# EAGLE schematic PR9023 (EAGLE 6.6.0)
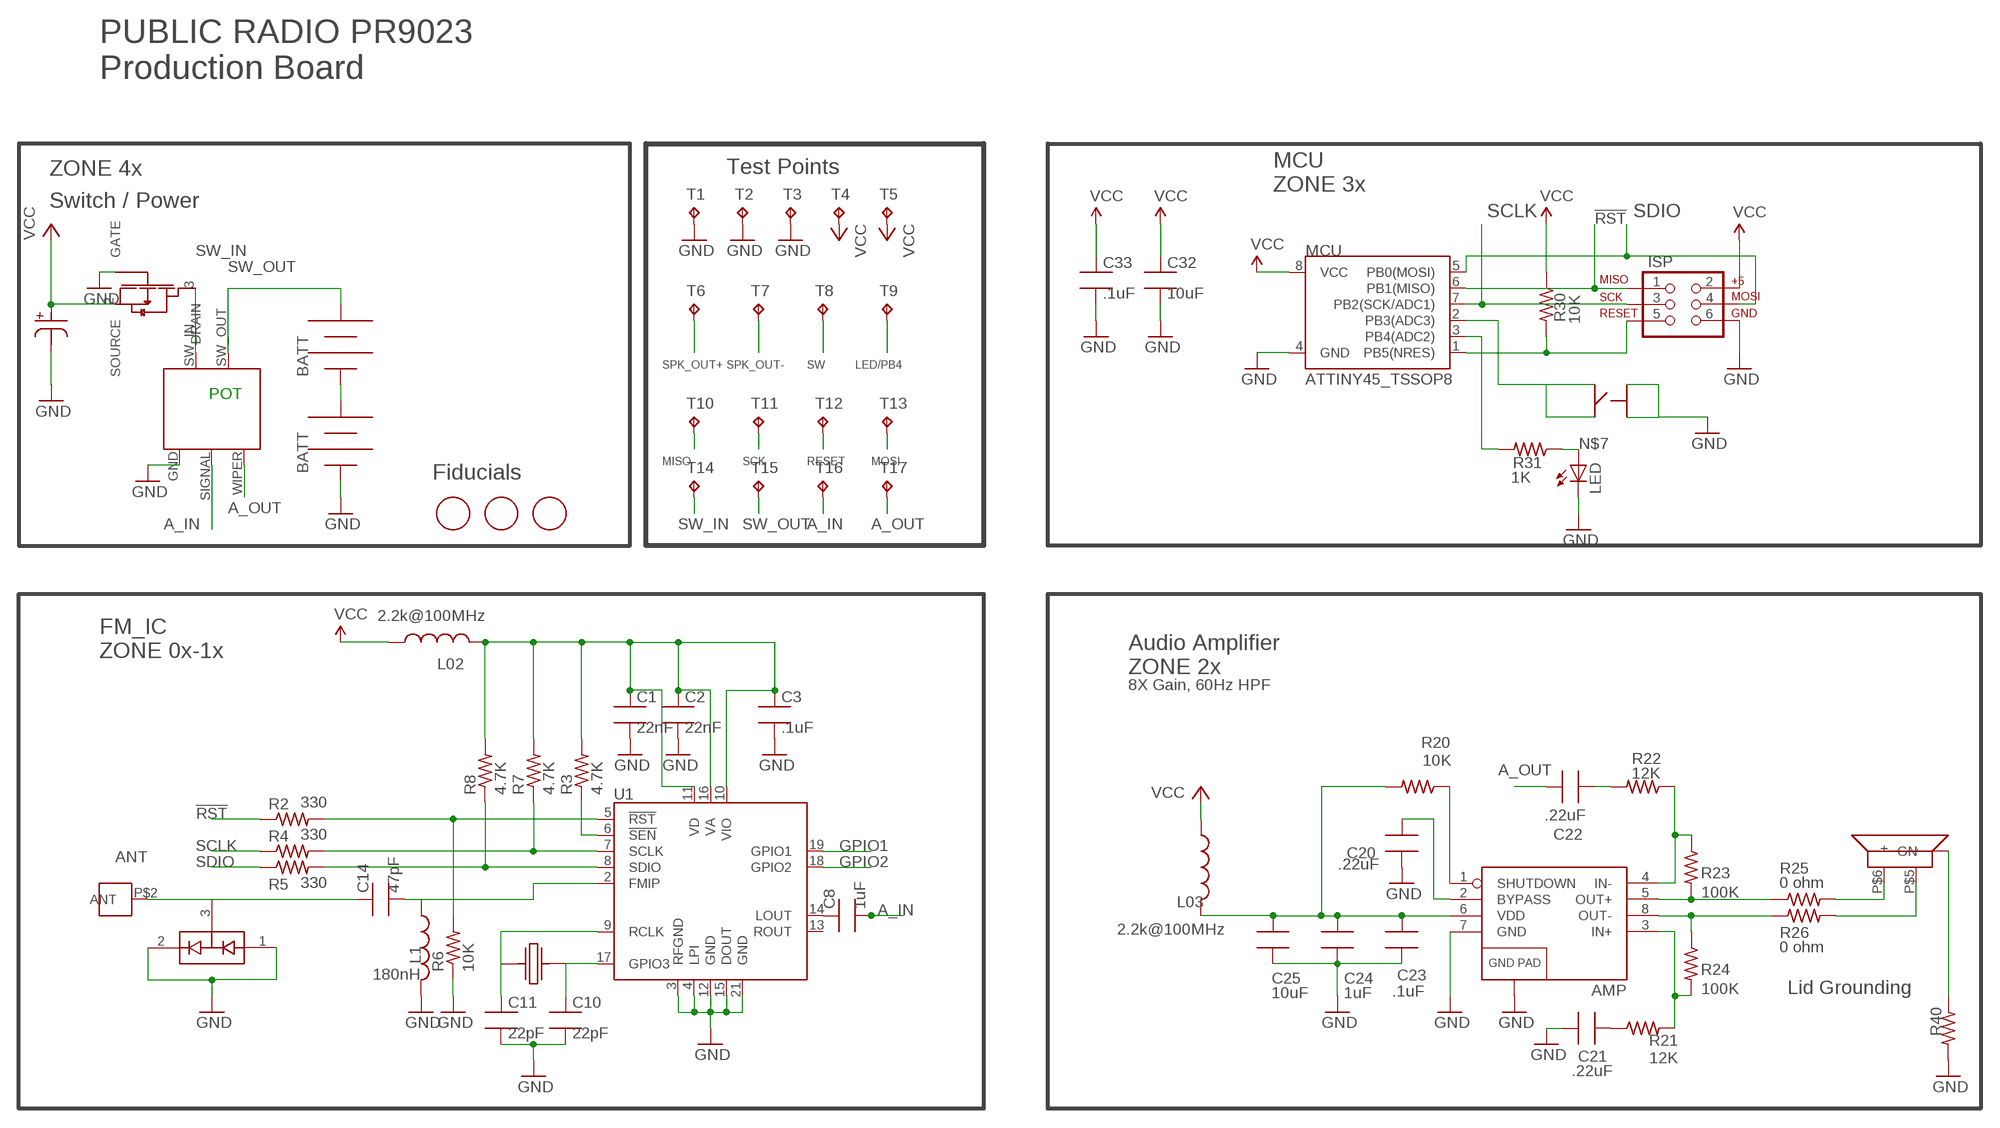
[diagram p0: schematic, sheet 1]

## Parts
AMP  TPA6203A1  [8-MSOP]
ANT_MOUNT  DNP  M3_PEMNUT  [PEM_M3]
C1  22nF  C_SMT_0603_CPL  [0603_CPL]
C2  22nF  C_SMT_0603_CPL  [0603_CPL]
C3  .1uF  C_SMT_0603_CPL  [0603_CPL]
C8  1uF  C_SMT_0603_CPL  [0603_CPL]
C10  22pF  C_SMT_0603_CPL  [0603_CPL]
C11  22pF  C_SMT_0603_CPL  [0603_CPL]
C14  47pF  C_SMT_0603_CPL  [0603_CPL]
C20  .22uF  C_SMT_0603_CPL  [0603_CPL]
C21  .22uF  C_SMT_0603_CPL  [0603_CPL]
C22  .22uF  C_SMT_0603_CPL  [0603_CPL]
C23  .1uF  C_SMT_0603_CPL  [0603_CPL]
C24  1uF  C_SMT_0603_CPL  [0603_CPL]
C25  10uF  C_SMT_0603_CPL  [0603_CPL]
C32  10uF  C_SMT_0603_CPL  [0603_CPL]
C33  .1uF  C_SMT_0603_CPL  [0603_CPL]
C40  220uF  NICHICON_SERIESUD  [NICHICON_UD_63]
D1  BAV99  [SOT23_CPL]
FET1  AO3435  [SOT23_CPL]
ISP  AVR_SPI_PRG_6NS  [2X3-NS]
JP5  BK-92_MPD_AA_BATT_CLIP  [BK92_AA_BATT]
JP6  BK-92_MPD_AA_BATT_CLIP  [BK92_AA_BATT]
L1  180nH  L_SMT_0805_ADAFRUIT  [0805_ADAFRUIT]
L02  2.2k@100MHz  L_SMT_0603_CPL  [0603_CPL]
L03  2.2k@100MHz  L_SMT_0603_CPL  [0603_CPL]
LED  LEDCHIPLED_0805  [CHIPLED_0805]
MARK1  FIDUCIAL  [FIDUCIAL_1MM]
MARK2  FIDUCIAL  [FIDUCIAL_1MM]
MARK3  FIDUCIAL  [FIDUCIAL_1MM]
MCU  ATTINY45_TSSOP8  [TSSOP-8]
R1  RV170SF_TAIWANA_POT_SW  [RV170SF_SW_POT]
R2  330  R_SMT_R0603_CPL  [0603_CPL]
R3  4.7K  R_SMT_R0603_CPL  [0603_CPL]
R4  330  R_SMT_R0603_CPL  [0603_CPL]
R5  330  R_SMT_R0603_CPL  [0603_CPL]
R6  10K  R_SMT_R0603_CPL  [0603_CPL]
R7  4.7K  R_SMT_R0603_CPL  [0603_CPL]
R8  4.7K  R_SMT_R0603_CPL  [0603_CPL]
R20  10K  R_SMT_R0603_CPL  [0603_CPL]
R21  12K  R_SMT_R0603_CPL  [0603_CPL]
R22  12K  R_SMT_R0603_CPL  [0603_CPL]
R23  100K  R_SMT_R0603_CPL  [0603_CPL]
R24  100K  R_SMT_R0603_CPL  [0603_CPL]
R25  0 ohm  R_SMT_0805_ADAFRUIT  [0805_ADAFRUIT]
R26  0 ohm  R_SMT_0805_ADAFRUIT  [0805_ADAFRUIT]
R30  10K  R_SMT_R0603_CPL  [0603_CPL]
R31  1K  R_SMT_R0603_CPL  [0603_CPL]
R40  DNP  R_SMT_R0603_CPL  [0603_CPL]
SPKR_PLACE  DNP  PR2024_SPKR_SMD  [PR2024_SPKR_PLACE(SMD)]
SW1  ESWT_TL3315  [E_SWITCH_TL3315]
T1  TPTP20R  [TP20R]
T2  TPTP20R  [TP20R]
T3  TPTP20R  [TP20R]
T4  TPTP20R  [TP20R]
T5  TPTP20R  [TP20R]
T6  TPTP20R  [TP20R]
T7  TPTP20R  [TP20R]
T8  TPTP20R  [TP20R]
T9  TPTP20R  [TP20R]
T10  TPTP20R  [TP20R]
T11  TPTP20R  [TP20R]
T12  TPTP20R  [TP20R]
T13  TPTP20R  [TP20R]
T14  TPTP20R  [TP20R]
T15  TPTP20R  [TP20R]
T16  TPTP20R  [TP20R]
T17  TPTP20R  [TP20R]
U1  SI4702-C19-GMR  [SI470X_20_QFN]
X1  ABS25XTAL  [4-SOJ]

## Nets
3.3V: C1.1 C2.1 C3.1 L02.2 R3.2 R7.2 R8.2 U1.10(VIO) U1.11(VD) U1.16(VA)
!RST: ISP.1 MCU.6(PB1(MISO)) R2.1 T10.TP
!RST-L: R2.2 R6.2 U1.5(!RST)
!SEN-L: R3.1 U1.6(!SEN)
A_IN: C8.2 R1.SIGNAL T16.TP
A_OUT: C22.2 R1.WIPER T17.TP
ANT [antenna]: ANT_MOUNT.P$2(ANT) C14.1 D1.3(COM)
GND: AMP.7(GND) AMP.9(GND) C1.2 C2.2 C3.2 C10.2 C11.2 C20.1 C21.1 C23.2 C24.2 C25.2 C32.2 C33.2 C40.P$2 D1.1(A1) D1.2(C2) FET1.1(GATE) ISP.6 JP6.NEG JP6.NEG@2(NEG) L1.2 LED.C MCU.4(GND) R1.GND R6.1 R40.2 SW1.P$1 SW1.P$2 T1.TP T2.TP T3.TP U1.3(RFGND) U1.4(LPI) U1.12(GND) U1.15(DOUT) U1.21(GND)
GPIO1: U1.19(GPIO1)
GPIO2: U1.18(GPIO2)
LED/PB4: MCU.3(PB4(ADC2)) R31.2 T9.TP
N$1: C11.1 U1.9(RCLK) X1.P$1
N$2: AMP.6(VDD) C23.1 C24.1 C25.1 L03.2 R20.2
N$3: C22.1 R22.2
N$4: AMP.5(OUT+) R23.2 R25.1
N$5: AMP.3(IN+) R21.2 R24.2
N$6: R40.1 SPKR_PLACE.P$4(GN)
N$7: LED.A R31.1
N$9: C8.1 U1.14(LOUT)
N$10: C10.1 U1.17(GPIO3) X1.P$4
N$11: AMP.8(OUT-) R24.1 R26.1
N$12: AMP.2(BYPASS) C20.2
N$13: JP5.NEG JP5.NEG@2(NEG) JP6.POS JP6.POS@2(POS)
N$14: AMP.4(IN-) R22.1 R23.1
N$16 [antenna]: C14.2 L1.1 U1.2(FMIP)
N$20: AMP.1(SHUTDOWN) R20.1
N$23: C21.2 R21.1
RESET: ISP.5 MCU.1(PB5(NRES)) R30.2 T12.TP
SCLK: ISP.3 MCU.7(PB2(SCK/ADC1)) R4.1 T11.TP
SCLK-L: R4.2 R7.1 U1.7(SCLK)
SDIO: ISP.4 MCU.5(PB0(MOSI)) R5.1 T13.TP
SDIO-L: R5.2 R8.1 U1.8(SDIO)
SPK_OUT+: R25.2 SPKR_PLACE.P$6(+) T6.TP
SPK_OUT-: R26.2 SPKR_PLACE.P$5(-) T7.TP
SW: MCU.2(PB3(ADC3)) SW1.P$3 SW1.P$4 T8.TP
SW_IN: FET1.3(DRAIN) R1.SW_IN T14.TP
SW_OUT: JP5.POS JP5.POS@2(POS) R1.SW_OUT T15.TP
VCC: C32.1 C33.1 C40.P$1 FET1.2(SOURCE) ISP.2 L02.1 L03.1 MCU.8(VCC) R30.1 T4.TP T5.TP
Unconnected: U1.13(ROUT)

## Notes on the sheet
- PUBLIC RADIO PR9023
  Production Board
- ZONE 4x | Test Points
- MCU
  ZONE 3x
- Switch / Power
- POT
- MISO | SCK | RESET | MOSI
- Fiducials
- FM_IC
  ZONE 0x-1x
- Audio Amplifier 
  ZONE 2x
- 8X Gain, 60Hz HPF
- Lid Grounding

## Library data of the parts
AMP = PR_Parts_Library:TPA6203A1: IC AMP AUDIO PWR 1.25W AB 8MSOP; MFG_PN: TPA6203A1DGNR
ANT_MOUNT = PR_Parts_Library:M3_PEMNUT
C1 C2 = PR_Parts_Library:C_SMT: SMT capacitor; MFG_PN: CL10B223KB8NNNC; TOL: 10%; VOLTAGE: 16V
C3 C23 C33 = PR_Parts_Library:C_SMT: SMT capacitor; MFG_PN: CL10B104KB8SFNC; TOL: 10%; VOLTAGE: 16V
C8 C24 = PR_Parts_Library:C_SMT: SMT capacitor; MFG_PN: CL10B105KP8NNNC; TOL: 10%; VOLTAGE: 10V
C10 C11 = PR_Parts_Library:C_SMT: SMT capacitor; MFG_PN: C1608C0G1H220J080AA; TOL: 5%; VOLTAGE: 50V
C14 = PR_Parts_Library:C_SMT: SMT capacitor; MFG_PN: CL10C470JB8NCNC; TOL: 5%; VOLTAGE: 50V
C20-C22 = PR_Parts_Library:C_SMT: SMT capacitor; MFG_PN: C1608X7R1C224K080AC; TOL: 10%; VOLTAGE: 16V
C25 C32 = PR_Parts_Library:C_SMT: SMT capacitor; MFG_PN: CL10A106MQ8NNNC; TOL: 20%; VOLTAGE: 6.3V
C40 = PR_Parts_Library:NICHICON_SERIESUD: Nichicon UD Series 220uf Cap MFG# UUD1C221MCL1GS; MFG_PN: UUD1C221MCL1GS; TOL: 20%; VOLTAGE: 16V
D1 = PR_Parts_Library:BAV99: DIODE ARRAY GP 100V 215MA SOT23; MFG_PN: BAV99,215
FET1 = PR_Parts_Library:AO3435: MOSFET P-CH 20V 2.9A SOT23; MFG_PN: AO3435
ISP = PR_Parts_Library:AVR_SPI_PRG_6: DIL VERTICAL PC TAIL PIN HEADER; MFG_PN: M20-9980346
JP5 JP6 = PR_Parts_Library:BK-92_MPD_AA_BATT_CLIP: Thru hole AA battery clip pair.; MFG_PN: 2 of BK92 - supplied by CL Labs
L1 = PR_Parts_Library:L_SMT: SMT inductor; CURRENT: 400mA; DCR: 640m; MFG_PN: AISC-0805-R18J-T; TOL: 5%
L02 L03 = PR_Parts_Library:L_SMT: SMT inductor; CURRENT: 150mA; DCR: 2.3; MFG_PN: HZ0603A222R-10
LED = adafruit:LED: LED OSRAM: - CHIPLED LG R971, LG N971, LY N971, LG Q971, LY Q971, LO R971, LY R971 LH N974, LH R974 LS Q976, LO Q976, LY Q976 LO Q996 - Hyper CHIPLED LW Q18S LB Q993, LB Q99A, LB R99A - SideLED LS A670, LO A670, LY A670, LG A670, LP A670 LB A673, LV A673, LT A673, LW A673 LH A674 LY A675 LS A676, LA A676, LO A676, LY A676, LW A676 LS A679, LY A679, LG A679 - Hyper Micro SIDELED® LS Y876, LA Y876, LO Y876, LY Y876 LT Y87S - SmartLED LW L88C, LW L88S LB L89C, LB L89S, LG L890 LS L89K, LO L89K, LY L89K LS L896, LA L896, LO L896, LY L896 - TOPLED LS T670, LO T670, LY T670, LG T670, LP T670 LSG T670, LSP T670, LSY T670, LOP T670, LYG T670 LG T671, LOG T671, LSG T671 LB T673, LV T673, LT T673, LW T673 LH T674 LS T676, LA T676, LO T676, LY T676, LB T676, LH T676, LSB T676, LW T676 LB T67C, LV T67C, LT T67C, LS T67K, LO T67K, LY T67K, LW E67C LS E67B, LA E67B, LO E67B, LY E67B, LB E67C, LV E67C, LT E67C LW T67C LS T679, LY T679, LG T679 LS T770, LO T770, LY T770, LG T770, LP T770 LB T773, LV T773, LT T773, LW T773 LH T774 LS E675, LA E675, LY E675, LS T675 LS T776, LA T776, LO T776, LY T776, LB T776 LHGB T686 LT T68C, LB T68C - Hyper Mini TOPLED® LB M676 - Mini TOPLED Santana® LG M470 LS M47K, LO M47K, LY M47K Source: http://www.osram.convergy.de/; MFG_PN: LY R976-PS-36
MARK1-MARK3 = PR_Parts_Library:FIDUCIAL: 1mm fiducial.; MFG_PN: DNP
MCU = PR_Parts_Library:ATTINY45_TSSOP8
R1 = PR_Parts_Library:RV170SF_TAIWANA_POT_SW: Thru hole switched potentiometer.; MFG_PN: RV170SF-43-20F-A10K - supplied by CL Labs
R2 R4 R5 = PR_Parts_Library:R_SMT: SMT resistor; MFG_PN: MCR03ERTJ331; POWER: 1/10W; TOL: 5%
R3 R7 R8 = PR_Parts_Library:R_SMT: SMT resistor; MFG_PN: ERJ-3EKF4701V; POWER: 1/10W; TOL: 1%
R6 R20 R30 = PR_Parts_Library:R_SMT: SMT resistor; MFG_PN: ERJ-3GEYJ103V; POWER: 1/10W; TOL: 5%
R21 R22 = PR_Parts_Library:R_SMT: SMT resistor; MFG_PN: RC0603FR-0712KL; POWER: 1/10W; TOL: 1%
R23 R24 = PR_Parts_Library:R_SMT: SMT resistor; MFG_PN: ERJ-3EKF1003V; POWER: 1/10W; TOL: 1%
R25 R26 = PR_Parts_Library:R_SMT: SMT resistor; MFG_PN: ERJ-6GEY0R00V
R31 = PR_Parts_Library:R_SMT: SMT resistor; MFG_PN: ERJ-3EKF1001V; POWER: 1/10W; TOL: 1%
R40 = PR_Parts_Library:R_SMT: SMT resistor; MFG_PN: ERJ-3GEY0R00V
SPKR_PLACE = PR_Parts_Library:PR2024_SPKR_SMD
SW1 = PR_Parts_Library:ESWT_TL3315; MFG_PN: TL3315NF100Q
T1-T17 = PR_Parts_Library:TP: Test pad; MFG_PN: DNP
U1 = PR_Parts_Library:SI4702-C19-GMR: IC FM RADIO TUNER 20-QFN; MFG_PN: Si4702 C19 GM - supplied by CL Labs
X1 = PR_Parts_Library:ABS25XTAL: 4PIN 32.768 Xtal MFG# ABS25-32.768KHZ-T; MFG_PN: ABS25-32.768KHZ-T

## Net classes
1 antenna: clearance 1.27 mm